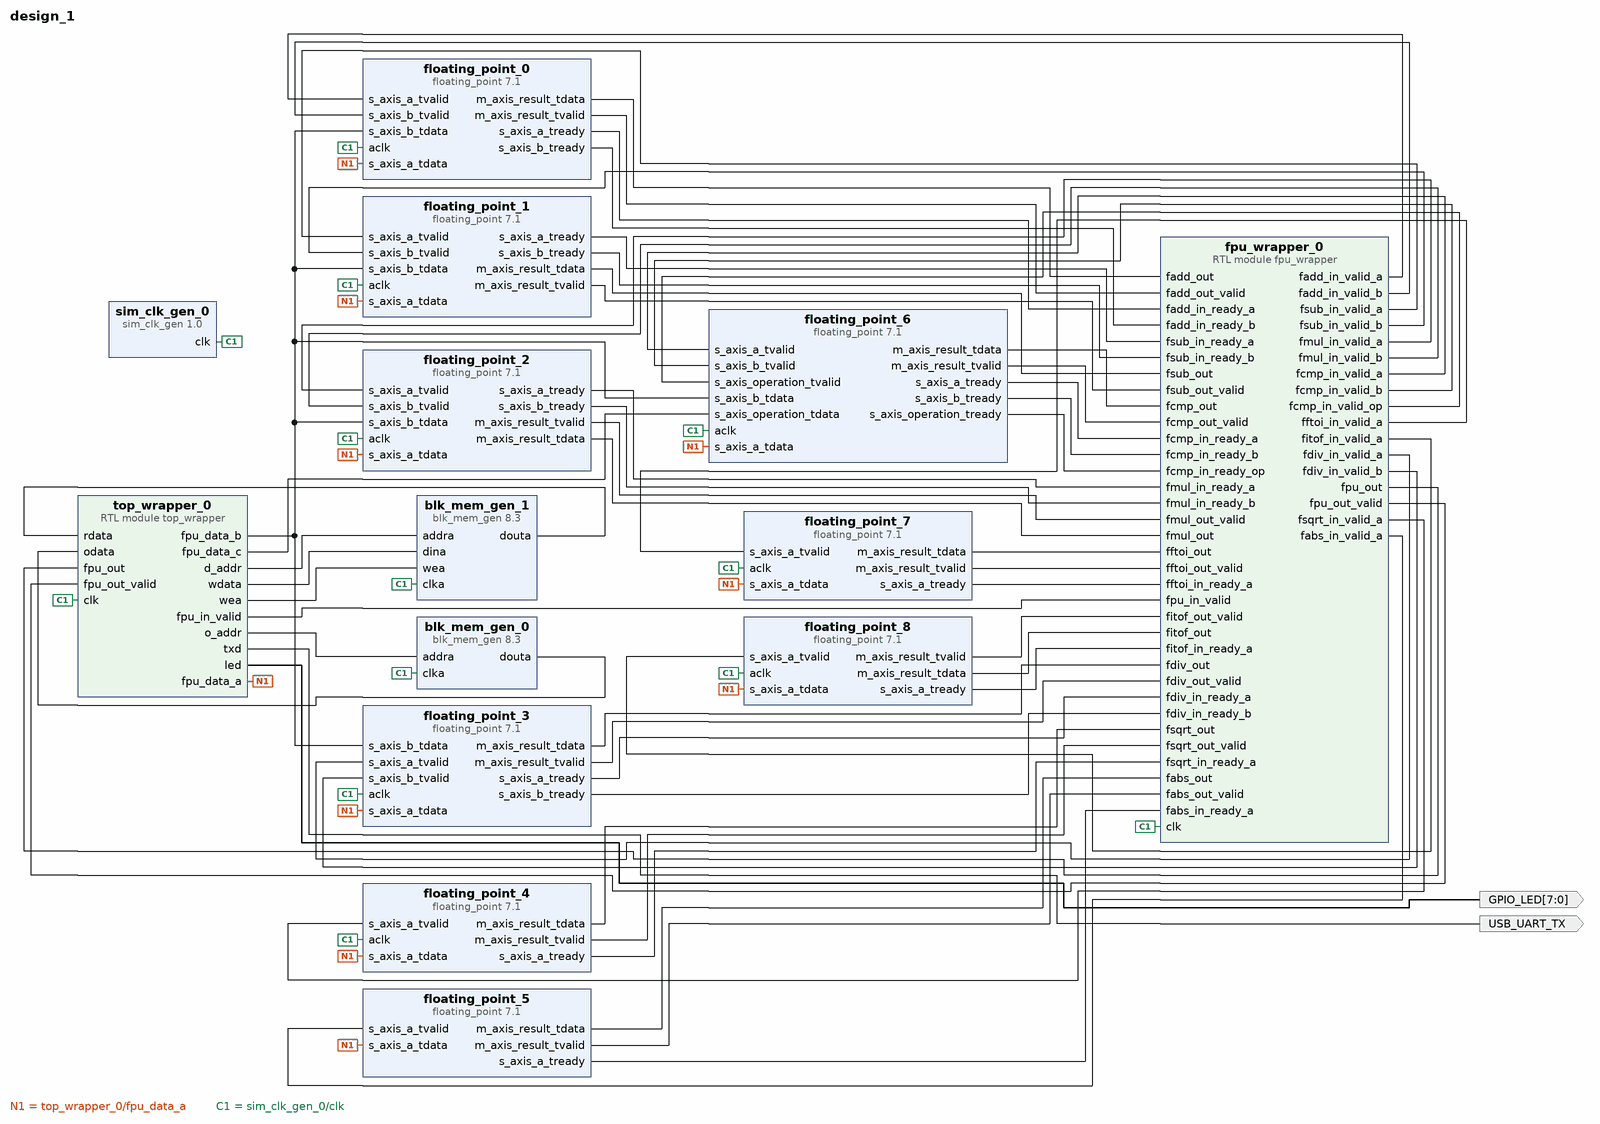
[diagram p0: block diagram of the top level]
# Vivado block design design_1, xcku040-ffva1156-2-e, Vivado 2016.4
create_bd_design design_1

create_bd_port -dir O -type data USB_UART_TX
create_bd_port -dir O -from 7 -to 0 -type data GPIO_LED

create_bd_cell -type ip -vlnv xilinx.com:ip:floating_point:7.1 floating_point_0
set_property -dict [list \
  CONFIG.Add_Sub_Value Add \
  CONFIG.Has_RESULT_TREADY false \
  CONFIG.Maximum_Latency false \
  CONFIG.C_Latency 1 \
] [get_bd_cells floating_point_0]
create_bd_cell -type ip -vlnv xilinx.com:ip:floating_point:7.1 floating_point_1
set_property -dict [list \
  CONFIG.Add_Sub_Value Subtract \
  CONFIG.Has_RESULT_TREADY false \
  CONFIG.Maximum_Latency false \
  CONFIG.C_Latency 1 \
] [get_bd_cells floating_point_1]
create_bd_cell -type ip -vlnv xilinx.com:ip:floating_point:7.1 floating_point_2
set_property -dict [list \
  CONFIG.Operation_Type Multiply \
  CONFIG.Result_Precision_Type Single \
  CONFIG.C_Result_Exponent_Width 8 \
  CONFIG.C_Result_Fraction_Width 24 \
  CONFIG.C_Mult_Usage Full_Usage \
  CONFIG.Has_RESULT_TREADY false \
  CONFIG.Maximum_Latency false \
  CONFIG.C_Latency 1 \
  CONFIG.C_Rate 1 \
] [get_bd_cells floating_point_2]
create_bd_cell -type ip -vlnv xilinx.com:ip:floating_point:7.1 floating_point_3
set_property -dict [list \
  CONFIG.Operation_Type Divide \
  CONFIG.Result_Precision_Type Single \
  CONFIG.C_Result_Exponent_Width 8 \
  CONFIG.C_Result_Fraction_Width 24 \
  CONFIG.C_Mult_Usage No_Usage \
  CONFIG.Has_RESULT_TREADY false \
  CONFIG.Maximum_Latency false \
  CONFIG.C_Latency 3 \
  CONFIG.C_Rate 1 \
] [get_bd_cells floating_point_3]
create_bd_cell -type ip -vlnv xilinx.com:ip:floating_point:7.1 floating_point_4
set_property -dict [list \
  CONFIG.Operation_Type Square_root \
  CONFIG.Result_Precision_Type Single \
  CONFIG.C_Result_Exponent_Width 8 \
  CONFIG.C_Result_Fraction_Width 24 \
  CONFIG.C_Mult_Usage No_Usage \
  CONFIG.Has_RESULT_TREADY false \
  CONFIG.Maximum_Latency false \
  CONFIG.C_Latency 3 \
  CONFIG.C_Rate 1 \
] [get_bd_cells floating_point_4]
create_bd_cell -type ip -vlnv xilinx.com:ip:floating_point:7.1 floating_point_5
set_property -dict [list \
  CONFIG.Operation_Type Absolute \
  CONFIG.Result_Precision_Type Single \
  CONFIG.C_Result_Exponent_Width 8 \
  CONFIG.C_Result_Fraction_Width 24 \
  CONFIG.C_Mult_Usage No_Usage \
  CONFIG.Has_RESULT_TREADY false \
  CONFIG.C_Latency 0 \
  CONFIG.C_Rate 1 \
] [get_bd_cells floating_point_5]
create_bd_cell -type ip -vlnv xilinx.com:ip:floating_point:7.1 floating_point_6
set_property -dict [list \
  CONFIG.Operation_Type Compare \
  CONFIG.Result_Precision_Type Custom \
  CONFIG.C_Result_Exponent_Width 1 \
  CONFIG.C_Result_Fraction_Width 0 \
  CONFIG.C_Mult_Usage No_Usage \
  CONFIG.Has_RESULT_TREADY false \
  CONFIG.Maximum_Latency false \
  CONFIG.C_Latency 1 \
  CONFIG.C_Rate 1 \
] [get_bd_cells floating_point_6]
create_bd_cell -type ip -vlnv xilinx.com:ip:floating_point:7.1 floating_point_7
set_property -dict [list \
  CONFIG.Operation_Type Float_to_fixed \
  CONFIG.Result_Precision_Type Int32 \
  CONFIG.C_Result_Exponent_Width 32 \
  CONFIG.C_Result_Fraction_Width 0 \
  CONFIG.C_Mult_Usage No_Usage \
  CONFIG.Has_RESULT_TREADY false \
  CONFIG.Maximum_Latency false \
  CONFIG.C_Latency 1 \
  CONFIG.C_Rate 1 \
] [get_bd_cells floating_point_7]
create_bd_cell -type ip -vlnv xilinx.com:ip:floating_point:7.1 floating_point_8
set_property -dict [list \
  CONFIG.Operation_Type Fixed_to_float \
  CONFIG.Result_Precision_Type Single \
  CONFIG.C_Result_Exponent_Width 8 \
  CONFIG.C_Result_Fraction_Width 24 \
  CONFIG.C_Accum_Msb 32 \
  CONFIG.C_Accum_Lsb -31 \
  CONFIG.C_Accum_Input_Msb 32 \
  CONFIG.C_Mult_Usage No_Usage \
  CONFIG.Has_RESULT_TREADY false \
  CONFIG.Maximum_Latency false \
  CONFIG.C_Latency 1 \
  CONFIG.C_Rate 1 \
] [get_bd_cells floating_point_8]
create_bd_cell -type ip -vlnv xilinx.com:ip:blk_mem_gen:8.3 blk_mem_gen_0
set_property -dict [list \
  CONFIG.Enable_32bit_Address false \
  CONFIG.Use_Byte_Write_Enable false \
  CONFIG.Enable_A Always_Enabled \
  CONFIG.Register_PortA_Output_of_Memory_Primitives false \
  CONFIG.Load_Init_File true \
  CONFIG.Coe_File ../../../../../../../mandel2.coe \
  CONFIG.Use_RSTA_Pin false \
  CONFIG.use_bram_block Stand_Alone \
] [get_bd_cells blk_mem_gen_0]
create_bd_cell -type ip -vlnv xilinx.com:ip:blk_mem_gen:8.3 blk_mem_gen_1
set_property -dict [list \
  CONFIG.Enable_32bit_Address false \
  CONFIG.Use_Byte_Write_Enable false \
  CONFIG.Enable_A Always_Enabled \
  CONFIG.Register_PortA_Output_of_Memory_Primitives false \
  CONFIG.Load_Init_File false \
  CONFIG.Use_RSTA_Pin false \
  CONFIG.use_bram_block Stand_Alone \
] [get_bd_cells blk_mem_gen_1]
create_bd_cell -type ip -vlnv xilinx.com:ip:sim_clk_gen:1.0 sim_clk_gen_0
create_bd_cell -type module -reference fpu_wrapper fpu_wrapper_0
create_bd_cell -type module -reference top_wrapper top_wrapper_0

# ---- connections ----

connect_bd_net [get_bd_pins top_wrapper_0/fpu_data_a] \
  [get_bd_pins floating_point_0/s_axis_a_tdata] [get_bd_pins floating_point_1/s_axis_a_tdata] \
  [get_bd_pins floating_point_2/s_axis_a_tdata] [get_bd_pins floating_point_3/s_axis_a_tdata] \
  [get_bd_pins floating_point_4/s_axis_a_tdata] [get_bd_pins floating_point_5/s_axis_a_tdata] \
  [get_bd_pins floating_point_6/s_axis_a_tdata] [get_bd_pins floating_point_7/s_axis_a_tdata] \
  [get_bd_pins floating_point_8/s_axis_a_tdata]
connect_bd_net [get_bd_pins floating_point_0/m_axis_result_tdata] [get_bd_pins fpu_wrapper_0/fadd_out]
connect_bd_net [get_bd_pins floating_point_0/m_axis_result_tvalid] [get_bd_pins fpu_wrapper_0/fadd_out_valid]
connect_bd_net [get_bd_pins fpu_wrapper_0/fadd_in_valid_a] [get_bd_pins floating_point_0/s_axis_a_tvalid]
connect_bd_net [get_bd_pins floating_point_0/s_axis_a_tready] [get_bd_pins fpu_wrapper_0/fadd_in_ready_a]
connect_bd_net [get_bd_pins floating_point_0/s_axis_b_tready] [get_bd_pins fpu_wrapper_0/fadd_in_ready_b]
connect_bd_net [get_bd_pins floating_point_1/s_axis_a_tready] [get_bd_pins fpu_wrapper_0/fsub_in_ready_a]
connect_bd_net [get_bd_pins floating_point_1/s_axis_b_tready] [get_bd_pins fpu_wrapper_0/fsub_in_ready_b]
connect_bd_net [get_bd_pins floating_point_1/m_axis_result_tdata] [get_bd_pins fpu_wrapper_0/fsub_out]
connect_bd_net [get_bd_pins floating_point_1/m_axis_result_tvalid] [get_bd_pins fpu_wrapper_0/fsub_out_valid]
connect_bd_net [get_bd_pins fpu_wrapper_0/fadd_in_valid_b] [get_bd_pins floating_point_0/s_axis_b_tvalid]
connect_bd_net [get_bd_pins fpu_wrapper_0/fsub_in_valid_a] [get_bd_pins floating_point_1/s_axis_a_tvalid]
connect_bd_net [get_bd_pins fpu_wrapper_0/fsub_in_valid_b] [get_bd_pins floating_point_1/s_axis_b_tvalid]
connect_bd_net [get_bd_pins fpu_wrapper_0/fmul_in_valid_a] [get_bd_pins floating_point_2/s_axis_a_tvalid]
connect_bd_net [get_bd_pins fpu_wrapper_0/fmul_in_valid_b] [get_bd_pins floating_point_2/s_axis_b_tvalid]
connect_bd_net [get_bd_pins floating_point_2/s_axis_a_tready] [get_bd_pins fpu_wrapper_0/fmul_in_ready_a]
connect_bd_net [get_bd_pins floating_point_2/s_axis_b_tready] [get_bd_pins fpu_wrapper_0/fmul_in_ready_b]
connect_bd_net [get_bd_pins floating_point_2/m_axis_result_tvalid] [get_bd_pins fpu_wrapper_0/fmul_out_valid]
connect_bd_net [get_bd_pins floating_point_3/m_axis_result_tdata] [get_bd_pins fpu_wrapper_0/fdiv_out]
connect_bd_net [get_bd_pins floating_point_3/m_axis_result_tvalid] [get_bd_pins fpu_wrapper_0/fdiv_out_valid]
connect_bd_net [get_bd_pins floating_point_3/s_axis_a_tready] [get_bd_pins fpu_wrapper_0/fdiv_in_ready_a]
connect_bd_net [get_bd_pins floating_point_3/s_axis_b_tready] [get_bd_pins fpu_wrapper_0/fdiv_in_ready_b]
connect_bd_net [get_bd_pins fpu_wrapper_0/fdiv_in_valid_a] [get_bd_pins floating_point_3/s_axis_a_tvalid]
connect_bd_net [get_bd_pins fpu_wrapper_0/fdiv_in_valid_b] [get_bd_pins floating_point_3/s_axis_b_tvalid]
connect_bd_net [get_bd_pins floating_point_4/m_axis_result_tdata] [get_bd_pins fpu_wrapper_0/fsqrt_out]
connect_bd_net [get_bd_pins floating_point_4/m_axis_result_tvalid] [get_bd_pins fpu_wrapper_0/fsqrt_out_valid]
connect_bd_net [get_bd_pins fpu_wrapper_0/fsqrt_in_valid_a] [get_bd_pins floating_point_4/s_axis_a_tvalid]
connect_bd_net [get_bd_pins floating_point_4/s_axis_a_tready] [get_bd_pins fpu_wrapper_0/fsqrt_in_ready_a]
connect_bd_net [get_bd_pins floating_point_2/m_axis_result_tdata] [get_bd_pins fpu_wrapper_0/fmul_out]
connect_bd_net [get_bd_pins floating_point_5/m_axis_result_tdata] [get_bd_pins fpu_wrapper_0/fabs_out]
connect_bd_net [get_bd_pins floating_point_5/m_axis_result_tvalid] [get_bd_pins fpu_wrapper_0/fabs_out_valid]
connect_bd_net [get_bd_pins floating_point_5/s_axis_a_tready] [get_bd_pins fpu_wrapper_0/fabs_in_ready_a]
connect_bd_net [get_bd_pins fpu_wrapper_0/fabs_in_valid_a] [get_bd_pins floating_point_5/s_axis_a_tvalid]
connect_bd_net [get_bd_pins floating_point_6/m_axis_result_tdata] [get_bd_pins fpu_wrapper_0/fcmp_out]
connect_bd_net [get_bd_pins floating_point_6/m_axis_result_tvalid] [get_bd_pins fpu_wrapper_0/fcmp_out_valid]
connect_bd_net [get_bd_pins floating_point_6/s_axis_a_tready] [get_bd_pins fpu_wrapper_0/fcmp_in_ready_a]
connect_bd_net [get_bd_pins floating_point_6/s_axis_b_tready] [get_bd_pins fpu_wrapper_0/fcmp_in_ready_b]
connect_bd_net [get_bd_pins floating_point_6/s_axis_operation_tready] [get_bd_pins fpu_wrapper_0/fcmp_in_ready_op]
connect_bd_net [get_bd_pins fpu_wrapper_0/fcmp_in_valid_a] [get_bd_pins floating_point_6/s_axis_a_tvalid]
connect_bd_net [get_bd_pins fpu_wrapper_0/fcmp_in_valid_b] [get_bd_pins floating_point_6/s_axis_b_tvalid]
connect_bd_net [get_bd_pins fpu_wrapper_0/fcmp_in_valid_op] [get_bd_pins floating_point_6/s_axis_operation_tvalid]
connect_bd_net [get_bd_pins top_wrapper_0/fpu_data_c] [get_bd_pins floating_point_6/s_axis_operation_tdata]
connect_bd_net [get_bd_pins floating_point_7/m_axis_result_tdata] [get_bd_pins fpu_wrapper_0/fftoi_out]
connect_bd_net [get_bd_pins floating_point_7/m_axis_result_tvalid] [get_bd_pins fpu_wrapper_0/fftoi_out_valid]
connect_bd_net [get_bd_pins floating_point_7/s_axis_a_tready] [get_bd_pins fpu_wrapper_0/fftoi_in_ready_a]
connect_bd_net [get_bd_pins fpu_wrapper_0/fftoi_in_valid_a] [get_bd_pins floating_point_7/s_axis_a_tvalid]
connect_bd_net [get_bd_pins fpu_wrapper_0/fitof_in_valid_a] [get_bd_pins floating_point_8/s_axis_a_tvalid]
connect_bd_net [get_bd_pins floating_point_8/m_axis_result_tvalid] [get_bd_pins fpu_wrapper_0/fitof_out_valid]
connect_bd_net [get_bd_pins floating_point_8/m_axis_result_tdata] [get_bd_pins fpu_wrapper_0/fitof_out]
connect_bd_net [get_bd_pins top_wrapper_0/fpu_in_valid] [get_bd_pins fpu_wrapper_0/fpu_in_valid]
connect_bd_net [get_bd_pins fpu_wrapper_0/fpu_out] [get_bd_pins top_wrapper_0/fpu_out]
connect_bd_net [get_bd_pins fpu_wrapper_0/fpu_out_valid] [get_bd_pins top_wrapper_0/fpu_out_valid]
connect_bd_net [get_bd_pins top_wrapper_0/o_addr] [get_bd_pins blk_mem_gen_0/addra]
connect_bd_net [get_bd_pins blk_mem_gen_0/douta] [get_bd_pins top_wrapper_0/odata]
connect_bd_net [get_bd_pins top_wrapper_0/d_addr] [get_bd_pins blk_mem_gen_1/addra]
connect_bd_net [get_bd_pins top_wrapper_0/wdata] [get_bd_pins blk_mem_gen_1/dina]
connect_bd_net [get_bd_pins blk_mem_gen_1/douta] [get_bd_pins top_wrapper_0/rdata]
connect_bd_net [get_bd_pins top_wrapper_0/wea] [get_bd_pins blk_mem_gen_1/wea]
connect_bd_net [get_bd_pins top_wrapper_0/txd] [get_bd_ports USB_UART_TX]
connect_bd_net [get_bd_pins top_wrapper_0/led] [get_bd_ports GPIO_LED]
connect_bd_net [get_bd_pins floating_point_8/s_axis_a_tready] [get_bd_pins fpu_wrapper_0/fitof_in_ready_a]
connect_bd_net [get_bd_pins sim_clk_gen_0/clk] \
  [get_bd_pins floating_point_4/aclk] [get_bd_pins floating_point_6/aclk] [get_bd_pins floating_point_7/aclk] \
  [get_bd_pins floating_point_8/aclk] [get_bd_pins floating_point_0/aclk] [get_bd_pins floating_point_1/aclk] \
  [get_bd_pins floating_point_2/aclk] [get_bd_pins floating_point_3/aclk] [get_bd_pins blk_mem_gen_0/clka] \
  [get_bd_pins blk_mem_gen_1/clka] [get_bd_pins fpu_wrapper_0/clk] [get_bd_pins top_wrapper_0/clk]
connect_bd_net [get_bd_pins top_wrapper_0/fpu_data_b] \
  [get_bd_pins floating_point_6/s_axis_b_tdata] [get_bd_pins floating_point_0/s_axis_b_tdata] \
  [get_bd_pins floating_point_1/s_axis_b_tdata] [get_bd_pins floating_point_2/s_axis_b_tdata] \
  [get_bd_pins floating_point_3/s_axis_b_tdata]

validate_bd_design
save_bd_design
